# EAGLE design arm (EAGLE 6.6.0)
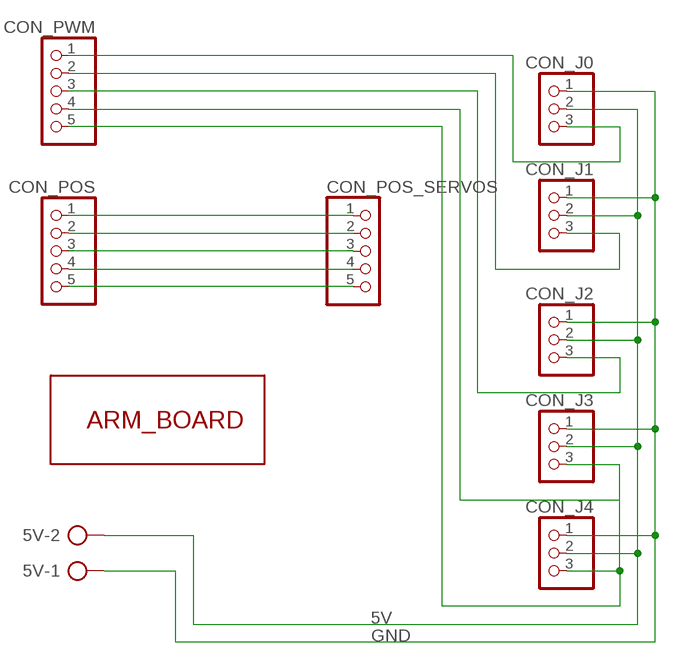
[diagram p0: schematic, sheet 1]

## Parts
5V  AK500/2  [AK500/2]
CON_J0  PINHD-1X3  [1X03]
CON_J1  PINHD-1X3  [1X03]
CON_J2  PINHD-1X3  [1X03]
CON_J3  PINHD-1X3  [1X03]
CON_J4  PINHD-1X3  [1X03]
CON_POS  PINHD-1X5  [1X05]
CON_POS_SERVOS  PINHD-1X5  [1X05]
CON_PWM  PINHD-1X5  [1X05]
U$1  ARM_BOARD  [ARM_BOARD]

## Nets
5V: 5V.2 CON_J0.2 CON_J1.2 CON_J2.2 CON_J3.2 CON_J4.2
GND: 5V.1 CON_J0.1 CON_J1.1 CON_J2.1 CON_J3.1 CON_J4.1
POS0: CON_POS.1 CON_POS_SERVOS.1
POS1: CON_POS.2 CON_POS_SERVOS.2
POS2: CON_POS.3 CON_POS_SERVOS.3
POS3: CON_POS.4 CON_POS_SERVOS.4
POS4: CON_POS.5 CON_POS_SERVOS.5
PWM0: CON_J0.3 CON_PWM.1
PWM1: CON_J1.3 CON_PWM.2
PWM2: CON_J2.3 CON_PWM.3
PWM3: CON_J3.3 CON_PWM.4
PWM4: CON_J4.3 CON_PWM.5

## Library data of the parts
5V = con-ptr500:AK500/2: CONNECTOR; OC_FARNELL: unknown; OC_NEWARK: unknown
CON_J0 CON_J1-CON_J4 = pinhead:PINHD-1X3: PIN HEADER
CON_POS CON_POS_SERVOS CON_PWM = pinhead:PINHD-1X5: PIN HEADER
U$1 = club:ARM_BOARD

## Board
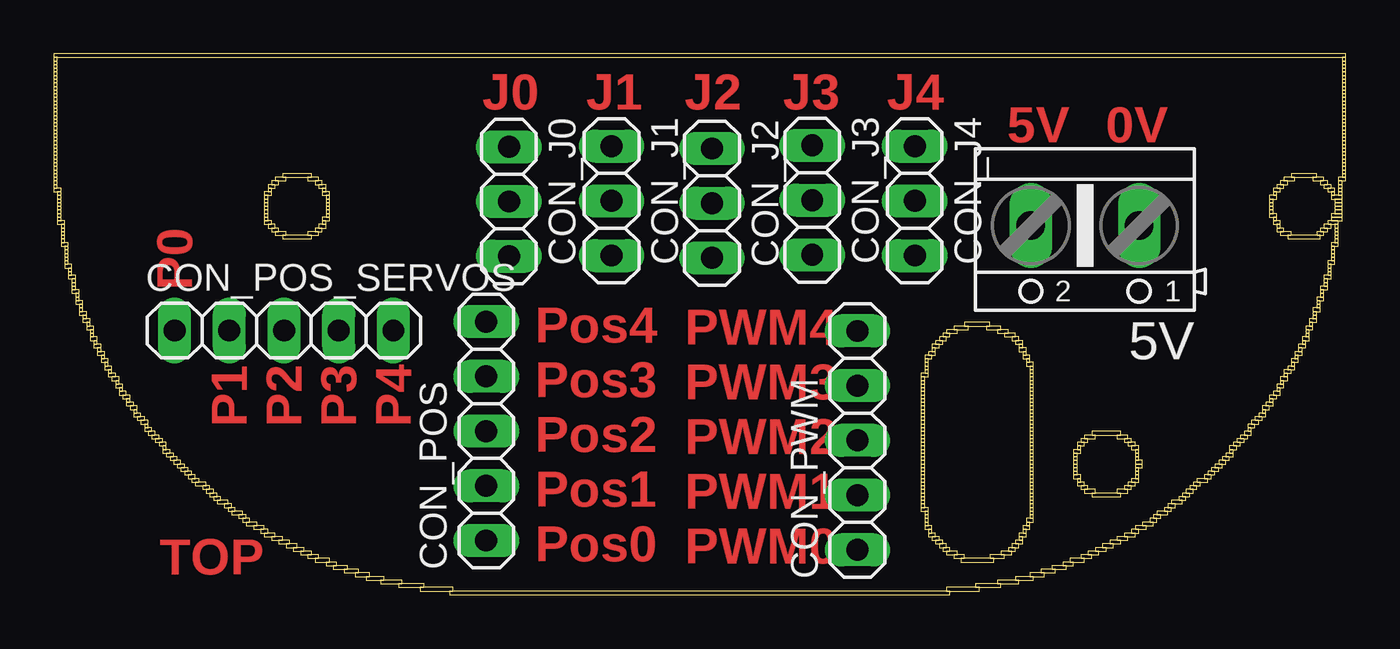
[diagram p1: board, top side]
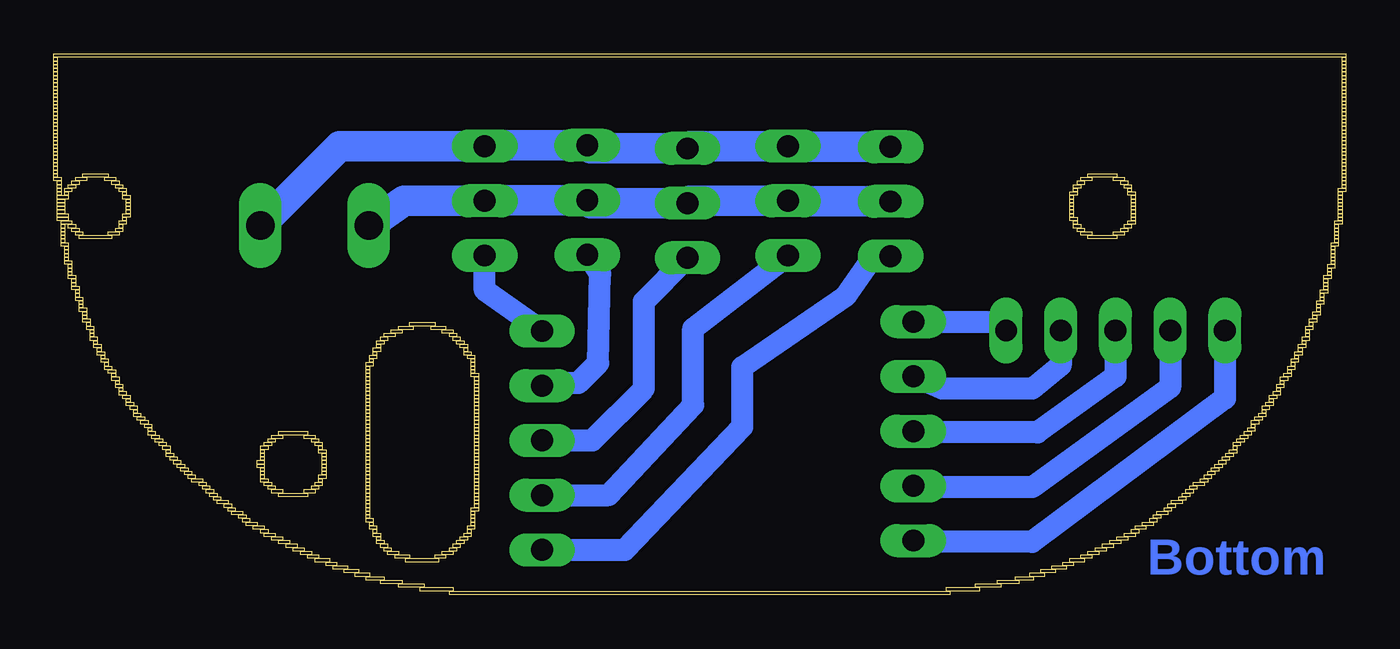
[diagram p2: board, bottom side, seen from below]

Size 60 x 25.11 mm. Coordinates in mm from the lower left corner, seen from the top.
Copper layers (1*16): Top 0.035mm / dielectric 1.5mm / Bottom 0.035mm
Design rules "default": minimum track width 10mil, minimum drill 24mil, track to track 8mil, track to pad 8mil, pad to pad 8mil, via to via 8mil, smd to smd 8mil, copper to edge 40mil, drill to drill 8mil, minimum pad ring 10mil, minimum via ring 8mil, stop-mask expansion 4mil, vias tented up to drill 0mil, thermal gap 10mil

### Footprints (pad centres in the part's own frame; a part is rotated, then mirrored left to right if it is on the bottom)
AK500/2 = drill 1.321 long: 1 -2.515,0; 2 2.515,0
1X03 = drill 1.016 long: 1 -2.54,0; 2 0,0; 3 2.54,0
1X05 = drill 1.016 long: 1 -5.08,0; 2 -2.54,0; 3 0,0; 4 2.54,0; 5 5.08,0

### Placement (x,y rotation side)
5V  47.89,17.14 180 top
CON_J0  21.14,18.26 270 top
CON_J1  25.9,18.29 270 top
CON_J2  30.57,18.18 270 top
CON_J3  35.22,18.32 270 top
CON_J4  39.99,18.29 270 top
CON_POS  20.08,7.6 90 top
CON_POS_SERVOS  10.69,12.27 0 top
CON_PWM  37.32,7.17 90 top
U$1  0.08,-0.08 0 top

### Tracks (layer width: path | path; a pad name or v marks a point on that pad's centre or on a via)
5V
  Bottom 1.016: CON_J4.2 39.95,18.32 | CON_J3.2 35.08,18.18 | CON_J2.2 30.46,18.29 | CON_J1.2 25.87,18.26
  Bottom 1.422: 5V.2 43.72,18.29 CON_J4.2 | 39.95,18.32 CON_J3.2 | 35.08,18.18 CON_J2.2 | 30.46,18.29 CON_J1.2 | 25.87,18.26 CON_J0.2
GND
  Bottom 1.016: CON_J4.1 39.95,20.86 | CON_J3.1 35.08,20.72 | CON_J2.1 30.46,20.83 | CON_J1.1 25.87,20.8
  Bottom 1.422: 5V.1 46.72,20.83 CON_J4.1 | 39.95,20.86 CON_J3.1 | 35.08,20.72 CON_J2.1 | 30.46,20.83 CON_J1.1 | 25.87,20.8 CON_J0.1
POS0
  Bottom 1.016: CON_POS_SERVOS.1 5.61,9.12 14.56,2.46 20.65,2.46 CON_POS.1
POS1
  Bottom 1.016: CON_POS_SERVOS.2 8.15,9.63 14.56,5 20.78,5 CON_POS.2
POS2
  Bottom 1.016: CON_POS_SERVOS.3 10.69,10.14 14.31,7.54 20.65,7.54 CON_POS.3
POS3
  Bottom 1.016: CON_POS_SERVOS.4 13.23,10.65 14.56,9.57 18.75,9.57 CON_POS.4
POS4
  Bottom 1.016: CON_POS.5 15.67,12.68 CON_POS_SERVOS.5
PWM0
  Bottom 1.016: CON_PWM.1 33.47,2.09 28.02,7.79 28.02,10.58 23.2,13.89 21.95,15.66 CON_J0.3
PWM1
  Bottom 1.016: CON_PWM.2 34.24,4.63 30.31,8.81 30.31,12.36 CON_J1.3
PWM2
  Bottom 1.016: CON_PWM.3 35,7.17 32.6,9.57 32.6,13.61 CON_J2.3
PWM3
  Bottom 1.016: CON_PWM.4 37.21,9.82 35.64,9.82 34.71,10.75 34.63,14.9 CON_J3.3
PWM4
  Bottom 1.016: CON_PWM.5 39.99,14.15 CON_J4.3

### Text on the board
Top: J0 | J1 | J2 | J3 | J4 | 5V | 0V | P0 | Pos4 | PWM4 | Pos3 | PWM3 | P1 | P2 | P3 | P4 | Pos2 | PWM2 | Pos1 | PWM1 | Pos0 | PWM0 | TOP
Bottom: Bottom